# Altium schematic sheet DAC_8CH.SchDoc
size A4
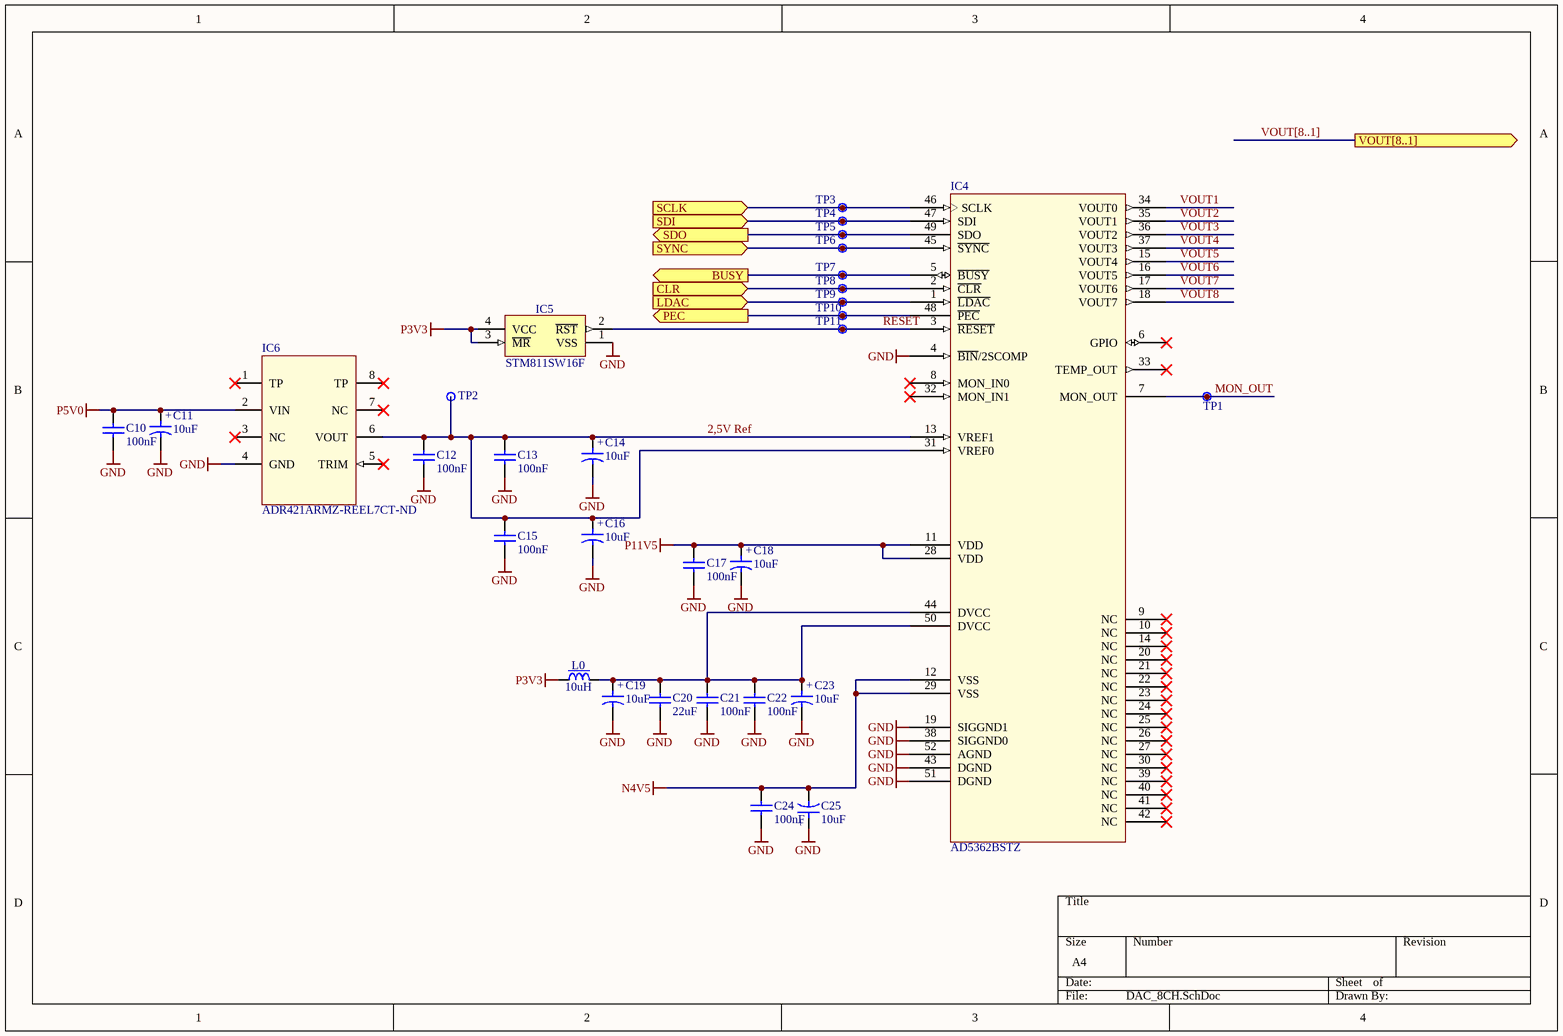
[diagram p0: DAC_8CH.SchDoc]

## Parts
C10  100nF  [C0402C104K4RACTU]
C11  10uF  [TCJT106M016R0200]
C12  100nF  [C0402C104K4RACTU]
C13  100nF  [C0402C104K4RACTU]
C14  10uF  [TCJT106M016R0200]
C15  100nF  [C0402C104K4RACTU]
C16  10uF  [TCJT106M016R0200]
C17  100nF  [C0402C104K4RACTU]
C18  10uF  [TCJT106M016R0200]
C19  10uF  [TCJT106M016R0200]
C20  22uF  [GRM219R61C226ME15K]
C21  100nF  [C0402C104K4RACTU]
C22  100nF  [C0402C104K4RACTU]
C23  10uF  [TCJT106M016R0200]
C24  100nF  [C0402C104K4RACTU]
C25  10uF  [TCJT106M016R0200]
IC4  AD5362BSTZ  [ST-52_L]
IC5  STM811SW16F  [SOT143N]
IC6  Supplier Part Number 1: ADR421ARMZ-REEL7CT-ND  [ADI-RM-8_N]  (hidden comment: ADR421ARMZ-REEL7)
L0  10uH  [IND_MURATA-PS_8400]
TP1  Test Point  [TPS127]  (value not drawn)
TP2  Test Point  [TPS127]  (value not drawn)
TP3  Test Point  [TPS127]  (value not drawn)
TP4  Test Point  [TPS127]  (value not drawn)
TP5  Test Point  [TPS127]  (value not drawn)
TP6  Test Point  [TPS127]  (value not drawn)
TP7  Test Point  [TPS127]  (value not drawn)
TP8  Test Point  [TPS127]  (value not drawn)
TP9  Test Point  [TPS127]  (value not drawn)
TP10  Test Point  [TPS127]  (value not drawn)
TP11  Test Point  [TPS127]  (value not drawn)

## Ports
BUSY (out), CLR (in), LDAC (in), PEC (out), SCLK (in), SDI (in), SDO (out), SYNC (in), VOUT[8..1] (out)

## Nets
GND: C10.1 C11.2 C12.1 C13.1 C14.2 C15.1 C16.2 C17.1 C18.2 C19.2 C20.1 C21.1 C22.1 C23.2 C24.1 C25.1 IC4.4(~{BIN}/2SCOMP) IC4.19(SIGGND1) IC4.38(SIGGND0) IC4.43(DGND) IC4.51(DGND) IC4.52(AGND) IC5.1(VSS) IC6.4(GND)
N4V5: C24.2 C25.2 IC4.12(VSS) IC4.29(VSS)
P3V3: IC5.3(~{MR}) IC5.4(VCC) L0.1
P5V0: C10.2 C11.1 IC6.2(VIN)
P11V5: C17.2 C18.1 IC4.11(VDD) IC4.28(VDD)
2,5V Ref: C12.2 C13.2 C14.1 C15.2 C16.1 IC4.13(VREF1) IC4.31(VREF0) IC6.6(VOUT) TP2.1
BUSY: IC4.5(~{BUSY}) TP7.1 ; port BUSY
CLR: IC4.2(~{CLR}) TP8.1 ; port CLR
LDAC: IC4.1(~{LDAC}) TP9.1 ; port LDAC
MON_OUT: IC4.7(MON_OUT) TP1.1
PEC: IC4.48(~{PEC}) TP10.1 ; port PEC
~{RESET}: IC4.3(~{RESET}) IC5.2(~{RST}) TP11.1
SCLK: IC4.46(SCLK) TP3.1 ; port SCLK
SDI: IC4.47(SDI) TP4.1 ; port SDI
SDO: IC4.49(SDO) TP5.1 ; port SDO
SYNC: IC4.45(~{SYNC}) TP6.1 ; port SYNC
VOUT1: IC4.34(VOUT0)
VOUT2: IC4.35(VOUT1)
VOUT3: IC4.36(VOUT2)
VOUT4: IC4.37(VOUT3)
VOUT5: IC4.15(VOUT4)
VOUT6: IC4.16(VOUT5)
VOUT7: IC4.17(VOUT6)
VOUT8: IC4.18(VOUT7)
NetC19_1: C19.1 C20.2 C21.2 C22.2 C23.1 IC4.44(DVCC) IC4.50(DVCC) L0.2

Not connected (* = marked no-connect by the designer): IC4 6(GPIO)* 8(MON_IN0)* 9(NC)* 10(NC)* 14(NC)* 20(NC)* 21(NC)* 22(NC)* 23(NC)* 24(NC)* 25(NC)* 26(NC)* 27(NC)* 30(NC)* 32(MON_IN1)* 33(TEMP_OUT)* 39(NC)* 40(NC)* 41(NC)* 42(NC)*; IC6 1(TP)* 3(NC)* 5(TRIM)* 7(NC)* 8(TP)*

## Buses and harness runs
bus VOUT[8..1] = port VOUT[8..1]

## Notes on the sheet
- (in symbol TCJT106M016R0200) +

## Library data of the parts
C10 C12 C13 C15 C17 C21 C22 C24 = C0402C104K4RACTU: Capacitor; Ceramic; Cap; .100uF; Tol 10%; SMT; Vol-Rtg 16V; X7R; Tape and Reel; Manufacturer 1: KEMET; Dissipation Factor: 3.5%; Supplier 1: Digi-Key; Manufacturer Part Number 1: C0402C104K4RACTU; Stock 1: 636137; Pricing 1: 1=0,10000, 10=0,04000, 50=0,02180, 100=0,01780, 500=0,01270, 1000=0,00998, 2500=0,00908, 5000=0,00835 (USD); RoHS: Yes; Mount: Surface Mount; Case/Package: 0402; Case Code (Imperial): 0402; Case Code (Metric): 1005; Contact Plating: Tin,Matte; Min Operating Temperature: -55°C; Max Operating Temperature: 125°C; Capacitance: 100nF; Tolerance: 10%; Packaging: Tape and Reel; Voltage Rating (DC): 16V; Dielectric: X7R; Package Quantity: 10000; Voltage Rating: 16V; Termination: SMD/SMT; Length: 1mm; Height: 0.5mm; Width: 0.5mm; Depth: 0.5mm; Radiation Hardening: No; ComponentLink1URL: https://datasheet.ciiva.com/45846/docfinderpartnumberc0402c102k5ractu-45846919.pdf?src-supplier=Onlinecomponents.com; ComponentLink1Description: https://datasheet.ciiva.com/45846/docfinderpartnumberc0402c102k5ractu-45846919.pdf?src-supplier=Onlinecomponents.com; ComponentLink2URL: https://datasheet.ciiva.com/18192/getdatasheetpartid-385384-18192412.pdf?src-supplier=Verical; ComponentLink2Description: https://datasheet.ciiva.com/18192/getdatasheetpartid-385384-18192412.pdf?src-supplier=Verical; Supplier Part Number 1: 399-3521-1-ND
C11 C14 C16 C18 C19 C23 C25 = TCJT106M016R0200: CAP TANT POLY 10UF 16V 1210; Manufacturer 1: Kyocera AVX; Tolerance: 20%; ESR (Equivalent Series Resistance): 200mR; Leakage Current: 16uA; Dissipation Factor: 6%; Supplier 1: Digi-Key; Manufacturer Part Number 1: TCJT106M016R0200; Stock 1: 1486; Pricing 1: 1=0,85000, 10=0,62700, 50=0,50140, 100=0,42980, 500=0,34026, 1000=0,28653 (USD); RoHS: Yes; Mount: Surface Mount; Case/Package: 1210; Case Code (Imperial): 1210; Case Code (Metric): 3528; Min Operating Temperature: -55°C; Max Operating Temperature: 125°C; Capacitance: 10uF; Termination: SMD/SMT; Voltage: 16V; Packaging: Tape and Reel; Package Quantity: 2500; Voltage Rating (DC): 16V; Voltage Rating: 16V; Length: 3.5mm; Height: 1.2mm; Depth: 2.8mm; Height - Seated (Max): 0.047inch; Width: 2.8mm; Radiation Hardening: No; ComponentLink1URL: https://datasheet.ciiva.com/11793/0900766b80eff593-11793120.pdf?src-supplier=RSComponents; ComponentLink1Description: https://datasheet.ciiva.com/11793/0900766b80eff593-11793120.pdf?src-supplier=RSComponents; ComponentLink2URL: https://datasheet.ciiva.com/6238/tcj-6238575.pdf?src-supplier=Digi-Key; ComponentLink2Description: https://datasheet.ciiva.com/6238/tcj-6238575.pdf?src-supplier=Digi-Key; ComponentLink3URL: https://datasheet.ciiva.com/11231/tcj-11231109.pdf?src-supplier=Avnet; ComponentLink3Description: https://datasheet.ciiva.com/11231/tcj-11231109.pdf?src-supplier=Avnet; Supplier Part Number 1: 478-11587-1-ND
C20 = GRM219R61C226ME15K: CAP CER 22uF 16V X5R 20% SMD 0805 85°C Embossed T/R; Manufacturer 1: Murata; Supplier 1: Digi-Key; Manufacturer Part Number 1: GRM219R61C226ME15K; Stock 1: 9158; Pricing 1: 1=0,46000, 10=0,32500, 50=0,24560, 100=0,21400, 500=0,15852, 1000=0,13473, 2500=0,12681, 5000=0,11888 (USD); RoHS: No; Voltage Rating (DC): 16V; Dielectric: X5R; Tolerance: 20%; Capacitance: 22uF; Length: 2mm; Width: 1.25mm; Thickness: 850um; Supplier Part Number 1: 490-GRM219R61C226ME15KCT-ND
IC4 = AD5362BSTZ: IC, 16BIT DAC, 8CH, SERIAL, 52LFCSP; Manufacturer 1: Analog Devices; Resolution: 16b; Settling Time: 20us; Integral Nonlinearity (INL): 4LSB; Output Type: Voltage; Interface: SPI,Serial; Number of Bits: 16; Sampling Rate: 540KS/s; Number of DAC Channels: 8; Max Supply Voltage: 16.5V; Min Supply Voltage: 8V; Max Power Dissipation: 209mW; Dual Supply Voltage: 15V; Differential Output: No; Polarity: Bipolar,Unipolar; Max Input Voltage: 5V; Min Input Voltage: 2V; Max Output Voltage: 20V; Slew Rate: 1V/µs; Nominal Supply Current: 8.5mA; Supplier 1: Arrow; Manufacturer Part Number 1: AD5362BSTZ; Stock 1: 15; Pricing 1: 1=43,05000, 5=41,82000, 10=40,47990, 25=37,43000, 50=36,88000, 100=33,58000, 250=32,20000 (USD); RoHS: Yes; Case/Package: LQFP; Number of Pins: 52; Contact Plating: Tin,Matte; Min Operating Temperature: -40°C; Max Operating Temperature: 85°C; Package Quantity: 1; Packaging: Tray; Max Dual Supply Voltage: 16.5V; Number of Converters: 8; Number of D/A Converters: 8; Power Dissipation: 209mW; Min Output Voltage: 8V; Number of Channels: 8; Number of Outputs: 8; Termination: SMD/SMT; Length: 10mm; Height: 1.4mm; Width: 10mm; Radiation Hardening: No; Lead Free: Contains Lead; REACH SVHC: No SVHC; ComponentLink1URL: https://datasheet.ciiva.com/1145/1789185-1145089.pdf?src-supplier=Avnet; ComponentLink1Description: https://datasheet.ciiva.com/1145/1789185-1145089.pdf?src-supplier=Avnet; ComponentLink2URL: https://datasheet.ciiva.com/1145/1789185-1145089.pdf?src-supplier=Farnell; ComponentLink2Description: https://datasheet.ciiva.com/1145/1789185-1145089.pdf?src-supplier=Farnell; ComponentLink3URL: https://datasheet.ciiva.com/26802/ad5362bstz-26802160.pdf?src-supplier=IIIC; ComponentLink3Description: https://datasheet.ciiva.com/26802/ad5362bstz-26802160.pdf?src-supplier=IIIC; ComponentLink4URL: https://datasheet.ciiva.com/1142/ad5362-5363-1142361.pdf?src-supplier=Element14; ComponentLink4Description: https://datasheet.ciiva.com/1142/ad5362-5363-1142361.pdf?src-supplier=Element14; ComponentLink5URL: https://datasheet.ciiva.com/1368/ad5362-5363-1368393.pdf?src-supplier=Digi-Key; ComponentLink5Description: https://datasheet.ciiva.com/1368/ad5362-5363-1368393.pdf?src-supplier=Digi-Key; ComponentLink6URL: https://datasheet.ciiva.com/8067/ad5362-5363-8067722.pdf?src-supplier=Element14; ComponentLink6Description: https://datasheet.ciiva.com/8067/ad5362-5363-8067722.pdf?src-supplier=Element14; ComponentLink7URL: https://datasheet.ciiva.com/15146/getdatasheetpartid-64274-15146331.pdf?src-supplier=Verical; ComponentLink7Description: https://datasheet.ciiva.com/15146/getdatasheetpartid-64274-15146331.pdf?src-supplier=Verical; ComponentLink8URL: https://datasheet.ciiva.com/16598/ad5362-5363-16598797.pdf?src-supplier=Avnet+Europe; ComponentLink8Description: https://datasheet.ciiva.com/16598/ad5362-5363-16598797.pdf?src-supplier=Avnet+Europe; Supplier Part Number 1: AD5362BSTZ
IC5 = STM811SW16F: Microprocessor Reset Circuit; Part Description: 2.93V Reset Threshold Voltage Microprocessor Reset Circuit; Manufacturer: ST MICROELECTRONICS; PressFit: No; Bonding: No; Part Number: STM811SW16F; Component Kind: Standard; Component Type: Standard; Device: STM811SW16F; PackageDescription: SOT143, 4-Leads, Body 3.0x2.6mm (max), Pitch 1.92mm, IPC Medium Density; Manufacturer Part Number: STM811SW16F; Pin Count: 4; Case: SOT143; Mounted: Yes; Socket: No; SMD: Yes; Sense: No; ComponentHeight: 1.12mm; Author: CERN DEM JLC; HelpURL: \\cern.ch\dfs\Applications\Altium\Datasheets\STM811SW16F.pdf; CreateDate: 17.11.2016; LatestRevisionDate: 17.11.2016
IC6 = ADR421ARMZ-REEL7: V-Ref Precision 2.5V 10mA 8-Pin MSOP T/R; Manufacturer 1: Analog Devices; Temperature Coefficient: 10ppm/°C; Max Input Voltage: 18V; Nominal Supply Current: 500uA; Tolerance: 0.12%; Reference Type: Series; Number of Channels: 1; Output Type: Fixed; Supplier 1: Digi-Key; Manufacturer Part Number 1: ADR421ARMZ-REEL7; Stock 1: 0; Pricing 1: 1=6,62000, 10=5,97700, 25=5,69920, 100=4,72600, 250=4,30900, 500=4,03100 (USD); RoHS: Yes; Mount: Surface Mount; Case/Package: MSOP; Number of Pins: 8; Min Operating Temperature: -40°C; Max Operating Temperature: 125°C; Output Voltage: 2.5V; Max Output Current: 10mA; Output Current: 10mA; Packaging: Tape and Reel; Max Output Voltage: 2.5V; Package Quantity: 1000; Min Output Voltage: 2.5V; Operating Supply Current: 500uA; Quiescent Current: 500uA; Length: 3.2mm; Height: 0.95mm; Width: 3.2mm; Radiation Hardening: No; Lead Free: Contains Lead; ComponentLink1URL: https://datasheet.ciiva.com/26889/adr421armz-reel7-26889000.pdf?src-supplier=IIIC; ComponentLink1Description: https://datasheet.ciiva.com/26889/adr421armz-reel7-26889000.pdf?src-supplier=IIIC
L0 = IND_10UH_10%_MURATA-PS_8400: Inductor With Core; Part Description: Miniature Surface Mount Power Inductor (8400 Series); Manufacturer: MURATA POWER SOLUTIONS; Manufacturer Part Number: 84103C; Power: 950mA; Resistance: 0.24R; Tolerance: ±10%; Part Number: IND_10UH_10%_MURATA-PS_8400; Component Kind: Standard; Component Type: Standard; Pin Count: 2; Value: 10uH; Status: None; Mounted: Yes; Socket: No; SMD: Yes; Sense: No; ComponentHeight: 2.9mm; HelpURL: \\cern.ch\dfs\Applications\Altium\Datasheets\IND_MURATA-PS_8400.pdf; Author: CERN DEM JLC; CreateDate: 02.07.2012; LatestRevisionDate: 02.07.2012
TP1-TP11 = SMD_PAD_1.27X1.27MM: Part Description: 1.27mm x 1.27mm PCB Copper Area (SMD Test Point); Mounted: No; Part Number: SMD_PAD_1.27X1.27MM; Component Kind: Standard (No BOM); Component Type: Standard (No BOM); Pin Count: 1; Family: Test Point; Socket: No; SMD: Yes; Sense: No; Status: None; ComponentHeight: 0mm; HelpURL: Undefined; Author: CERN DEM JLC; CreateDate: 12.01.2008; LatestRevisionDate: 12.01.2008; PackageDescription: 1.27mm x 1.27mm PCB Copper Area (SMD Test Point)